# Altium schematic sheet 51-2001-01-8_04 Power Module Schematic.SchDoc
size 431 x 279 mm; Organization: ORGANIZATION; Address1: ADDRESS 1; Address2: ADDRESS 2; Address3: ADDRESS 3; Address4: ADDRESS 4; Revision: -; SheetNumber: 4; SheetTotal: 4; ENG_APP_DATE: --/--/--; DSN_APP_DATE: --/--/--; CHK_APP_DATE: --/--/--
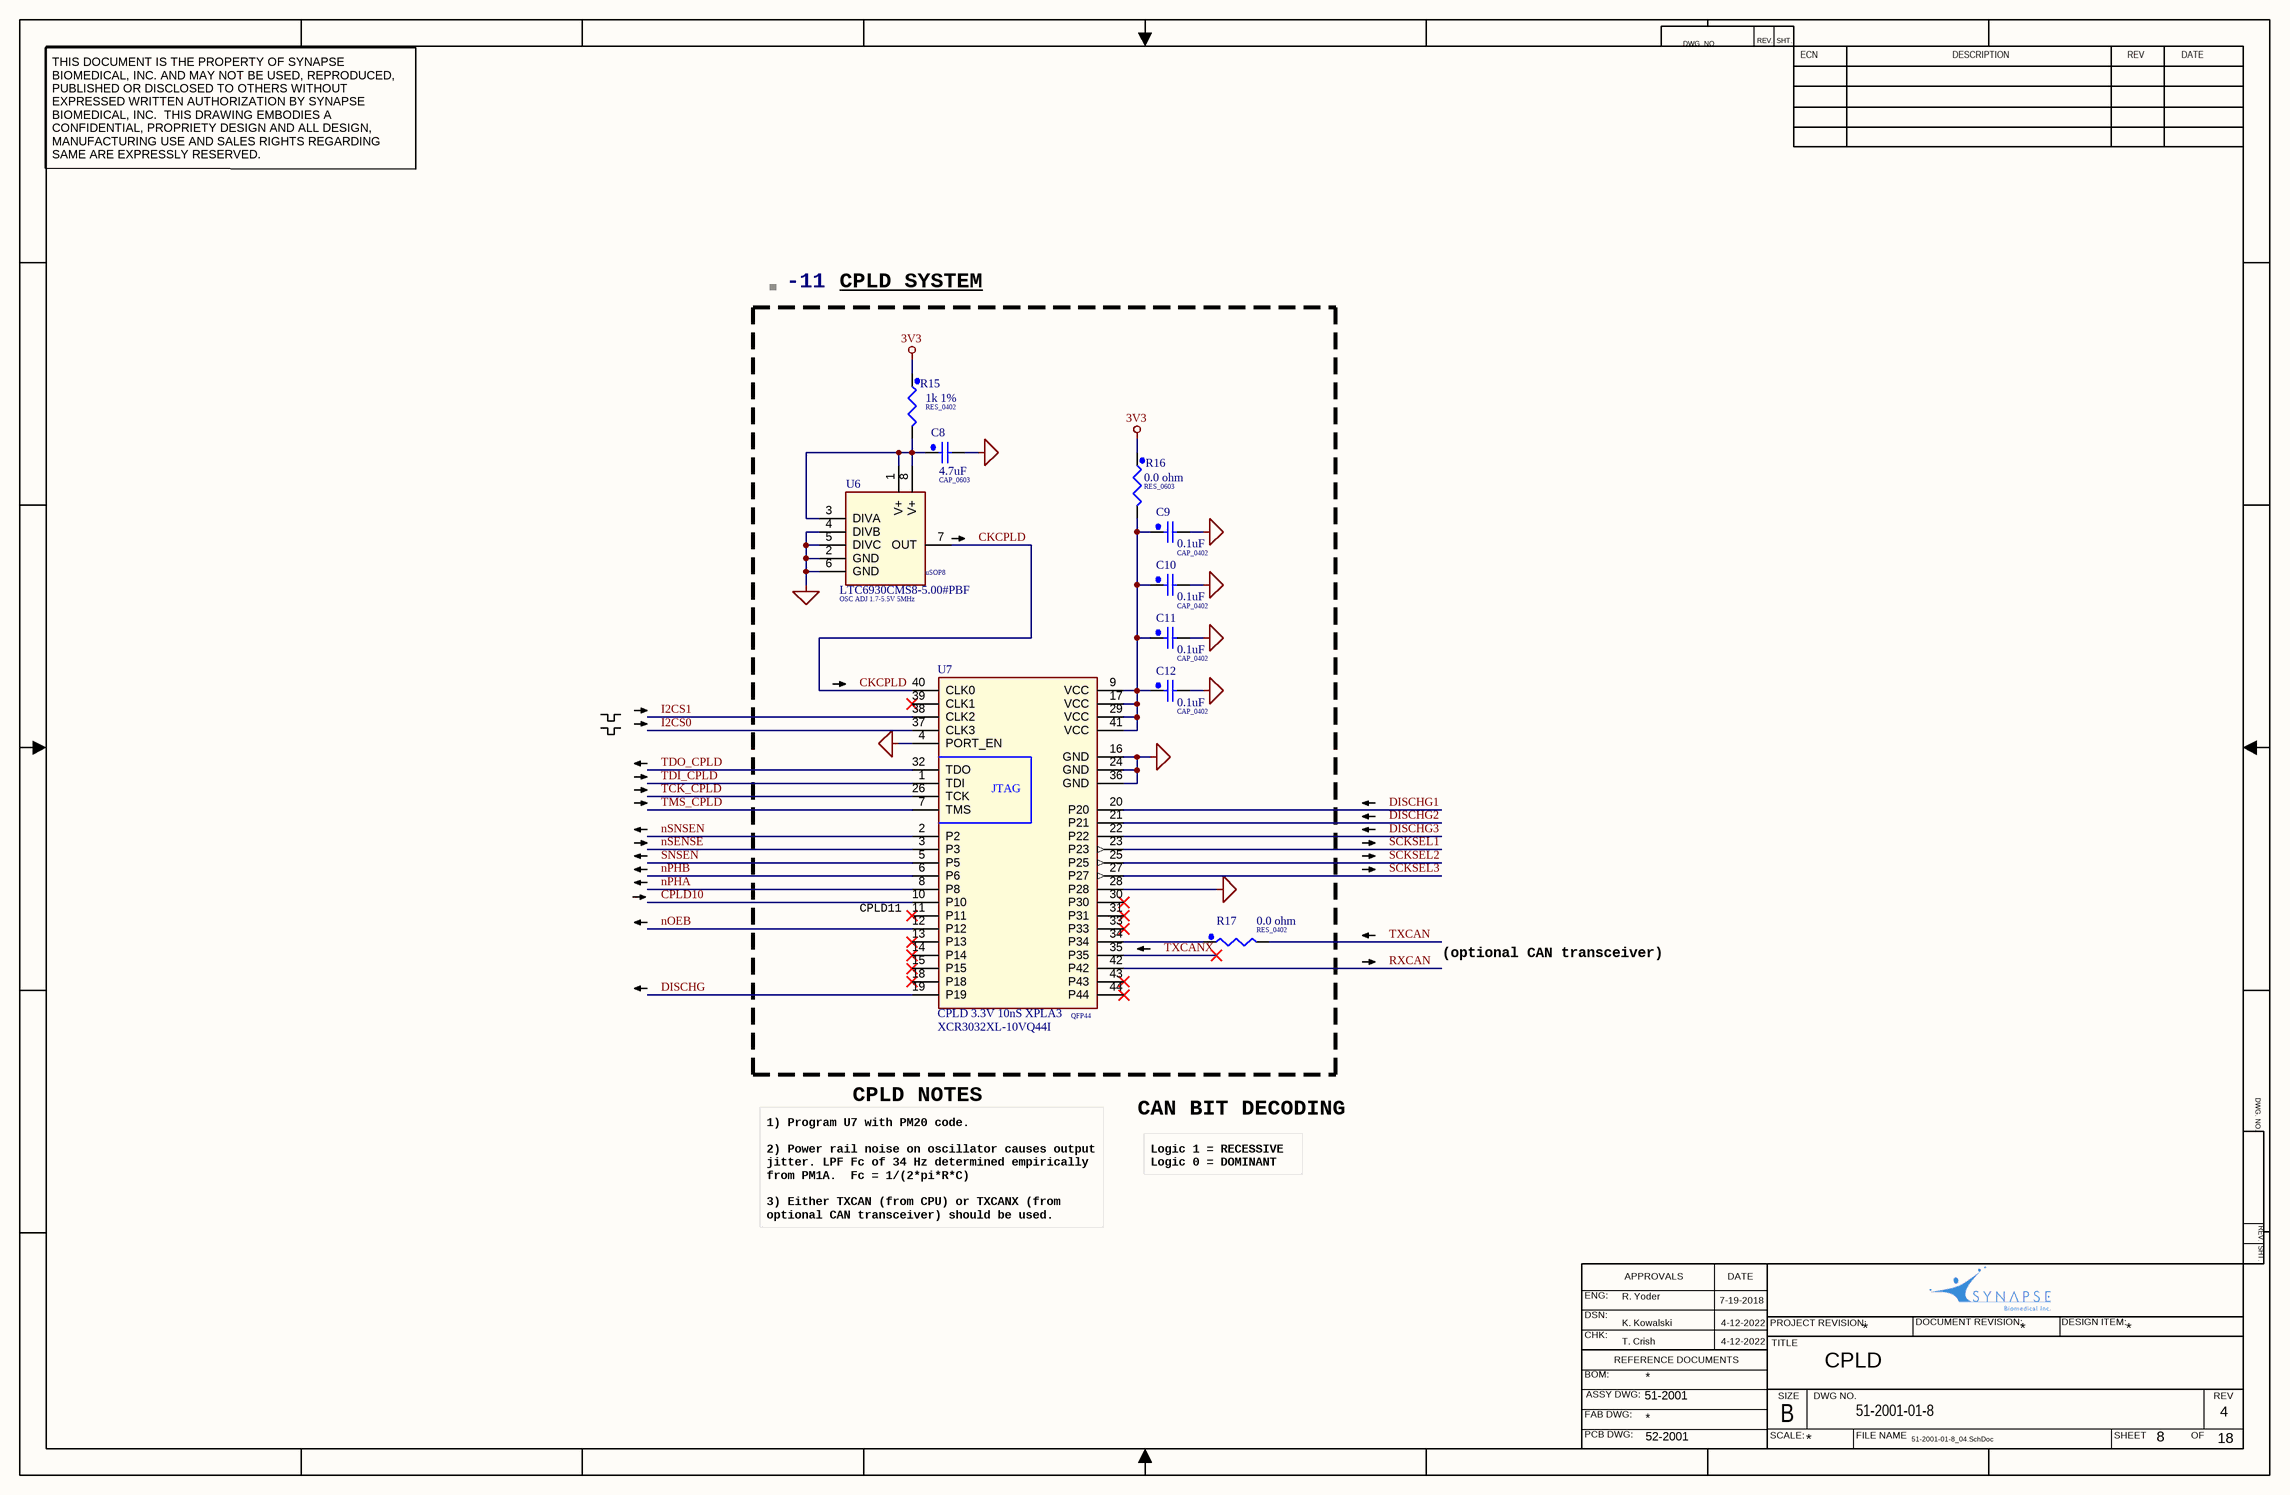
[diagram p0: 51-2001-01-8_04 Power Module Schematic.SchDoc]

## Parts
-11  XDESCRIPTION: CPLD SYSTEM  (hidden comment: BOM_S1)  (graphical)
C8  value 4.7uF  [CAP_0603]  (hidden comment: C_4u7_X5R_10_0603_10%)
C9  value 0.1uF  [CAP_0402]  (hidden comment: C_100n_X7R_16_0402_10%)
C10  value 0.1uF  [CAP_0402]  (hidden comment: C_100n_X7R_16_0402_10%)
C11  value 0.1uF  [CAP_0402]  (hidden comment: C_100n_X7R_16_0402_10%)
C12  value 0.1uF  [CAP_0402]  (hidden comment: C_100n_X7R_16_0402_10%)
R15  value 1k 1%  [RES_0402]  (hidden comment: R_1k_0402)
R16  value 0.0 ohm  [RES_0603]  (hidden comment: R_0_0603)
R17  value 0.0 ohm  [RES_0402]  (hidden comment: R_0_0402)
U6  OSC ADJ 1.7-5.5V 5MHz  PackageDescription: uSOP8  [MSOP-8L]
U7  CPLD 3.3V 10nS XPLA3  PackageDescription: QFP44  [VQFP-44]

## Blocks framed on the sheet
CPLD11: C8-C12 R15-R17 U6 U7

## Nets
3V3: R15.1 R16.1
GND: C8.2 C9.2 C10.2 C11.2 C12.2 U6.2(GND) U6.4(DIVB) U6.5(DIVC) U6.6(GND) U7.4(PORT_EN) U7.16(GND) U7.24(GND) U7.28(P28) U7.36(GND)
CKCPLD: U6.7(OUT) U7.40(CLK0)
CPLD10: U7.10(P10)
DISCHG: U7.19(P19)
DISCHG1: U7.20(P20)
DISCHG2: U7.21(P21)
DISCHG3: U7.22(P22)
I2CS0: U7.37(CLK3)
I2CS1: U7.38(CLK2)
nOEB: U7.12(P12)
nPHA: U7.8(P8)
nPHB: U7.6(P6)
nSENSE: U7.3(P3)
nSNSEN: U7.2(P2)
RXCAN: U7.42(P42)
SCKSEL1: U7.23(P23)
SCKSEL2: U7.25(P25)
SCKSEL3: U7.27(P27)
SNSEN: U7.5(P5)
TCK_CPLD: U7.26(TCK)
TDI_CPLD: U7.1(TDI)
TDO_CPLD: U7.32(TDO)
TMS_CPLD: U7.7(TMS)
TXCAN: R17.2
TXCANX: U7.35(P35)
NetC8_1: C8.1 R15.2 U6.1(V+) U6.3(DIVA) U6.8(V+)
NetC9_1: C9.1 C10.1 C11.1 C12.1 R16.2 U7.9(VCC) U7.17(VCC) U7.29(VCC) U7.41(VCC)
NetR17_1: R17.1 U7.34(P34)

Not connected (* = marked no-connect by the designer): U7 11(P11)* 13(P13)* 14(P14)* 15(P15)* 18(P18)* 30(P30)* 31(P31)* 33(P33)* 39(CLK1)* 43(P43)* 44(P44)*

## Notes on the sheet
- DWG. NO.
- REV.
- SHT.
- ECN
- DESCRIPTION
- REV
- DATE
- THIS DOCUMENT IS THE PROPERTY OF SYNAPSE BIOMEDICAL, INC. AND MAY NOT BE USED, REPRODUCED, PUBLISHED OR DISCLOSED TO OTHERS WITHOUT EXPRESSED WRITTEN AUTHORIZATION BY SYNAPSE BIOMEDICAL, INC.  THIS DRAWING EMBODIES A CONFIDENTIAL, PROPRIETY DESIGN AND ALL DESIGN, MANUFACTURING USE AND SALES RIGHTS REGARDING SAME ARE EXPRESSLY RESERVED.
- (optional CAN transceiver)
- CPLD NOTES
- CAN BIT DECODING
- Logic 1 = RECESSIVE
  Logic 0 = DOMINANT
- 1) Program U7 with PM20 code.
  2) Power rail noise on oscillator causes output jitter. LPF Fc of 34 Hz determined empirically from PM1A.  Fc = 1/(2*pi*R*C)
  3) Either TXCAN (from CPU) or TXCANX (from optional CAN transceiver) should be used.
- ENG:
- R. Yoder
- APPROVALS
- 7-19-2018
- DSN:
- CHK:
- REFERENCE DOCUMENTS
- K. Kowalski
- T. Crish
- 4-12-2022
- PROJECT REVISION:
- TITLE
- CPLD
- *
- DOCUMENT REVISION:
- DESIGN ITEM:
- BOM:
- FAB DWG:
- PCB DWG:
- ASSY DWG:
- 51-2001
- SCALE:
- SIZE
- B
- DWG NO.
- 51-2001-01-8
- FILE NAME
- SHEET
- OF
- 4
- 52-2001
- 51-2001-01-8_04.SchDoc
- 8
- 18
- (in symbol XCR3032XL-10VQ44I) JTAG

## Library data of the parts
-11 = BOM_S1: BOM item small graphic
C8 = LMK107BJ475KA-T: 4.7uF, 10V, X5R, 10%, 0603, RoHS; MFR: Murata Electronics North America; MPN: GRM185R61A475KE11D; SBI: 53-0076; PackageDescription: CAP_0603; Supplier 1: Digi-Key; Supplier Part Number 1: 490-11988-6-ND
C9-C12 = GRM155R71C104KA88D: 0.1uF, 16V, X7R, 0402, RoHS; MFR: Murata; SBI: 53-0040-1; PackageDescription: CAP_0402; Supplier 1: Digi-Key; Supplier Part Number 1: 490-3261-2-ND; MPN: GRM155R71C104KA88D
R15 = MCR01MZPF1001: 1.0k ohm 1% 1/16W smd 0402 RoHS; MFR: Vishay Dale; MPN: CRCW04021K00FKED; SBI: 53-0049-4; PackageDescription: RES_0402; Supplier 1: Digi-Key; Supplier Part Number 1: 541-1.00KLDKR-ND
R16 = MCR03ERTJ000: 0.0 ohm, 1/16W, 0603, RoHS; MFR: Vishay Dale; MPN: CRCW06030000Z0EA; SBI: 53-0075; PackageDescription: RES_0603; Supplier 1: Digi-Key; Supplier Part Number 1: 541-1.00KLDKR-ND
R17 = MCR01MZPJ000: 0.0 ohm, 1/16W, 0402, RoHS; MFR: Vishay Dale; MPN: CRCW04021K00FKED; SBI: 53-0048; PackageDescription: RES_0402; Supplier 1: Digi-Key; Supplier Part Number 1: 541-1.00KLDKR-ND
U6 = LTC6930CMS8-5.00#PBF: Precision µPower Oscillator, ADJ 1.7-5.5V,5MHz, uSOP8, RoHS; MFR: Linear Technology; SBI: 54-0090; Supplier 1: Digi-Key; Supplier Part Number 1: LTC6930CMS8-5.00#PBF-ND; MPN: LTC6930CMS8-5.00#PBF
U7 = XCR3032XL-10VQ44I: CPLD, 3.3V, 10nS, XPLA3, QFP48, RoHS; MFR: Xilinx; SBI: 56-0091; Value: *; Supplier 1: Digi-Key; Supplier Part Number 1: 122-1957-ND; MPN: XCR3032XL-10VQ44I